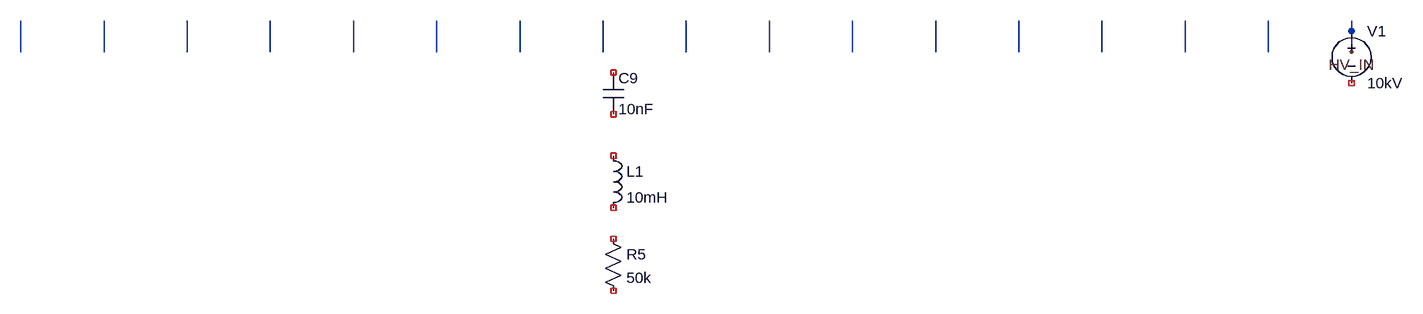
[diagram p0: schematic marx_generator_resonant.asc]
marx_generator_resonant.asc, the LTspice schematic file:
Version 4
SHEET 1 880 680
WIRE 64 64 64 112
WIRE 192 64 192 112
WIRE 320 64 320 112
WIRE 448 64 448 112
WIRE 576 64 576 112
WIRE 704 64 704 112
WIRE 832 64 832 112
WIRE 960 64 960 112
WIRE 1088 64 1088 112
WIRE 1216 64 1216 112
WIRE 1344 64 1344 112
WIRE 1472 64 1472 112
WIRE 1600 64 1600 112
WIRE 1728 64 1728 112
WIRE 1856 64 1856 112
WIRE 1984 64 1984 112
WIRE 2112 64 2112 112
FLAG 2112 112 HV_IN
SYMBOL voltage 2112 64 R0
SYMATTR InstName V1
SYMATTR Value 10kV
SYMBOL cap 960 144 R0
SYMATTR InstName C9
SYMATTR Value 10nF
SYMBOL ind 960 256 R0
SYMATTR InstName L1
SYMATTR Value 10mH
SYMBOL res 960 384 R0
SYMATTR InstName R5
SYMATTR Value 50k

The netlist it stands for:
* marx_generator_resonant.asc
V1 HV_IN NC_01 10kV
C9 NC_02 NC_03 10nF
L1 NC_04 NC_05 10mH
R5 NC_06 NC_07 50k
.backanno
.end